# Altium schematic sheet Input.SchDoc
size A4
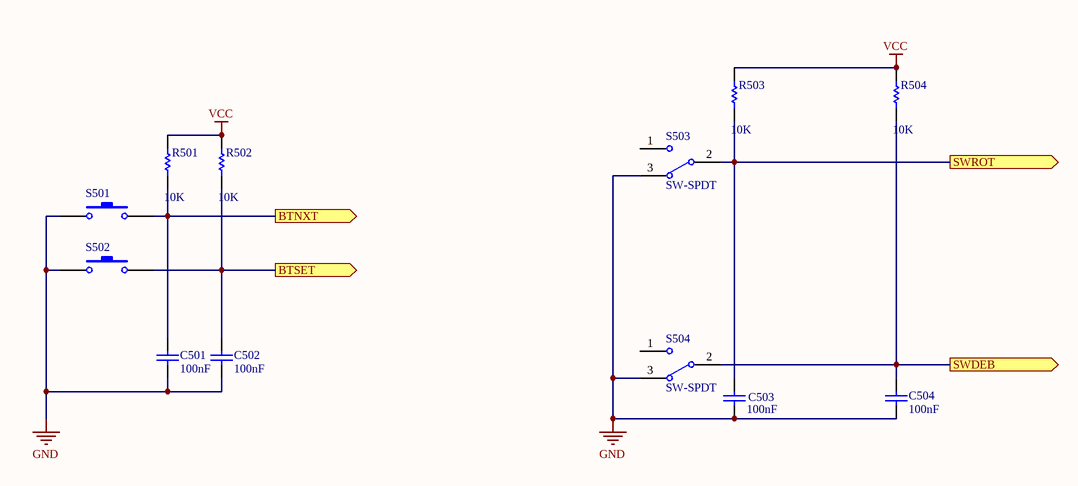
[diagram p0: Input.SchDoc]

## Parts
C501  value 100nF  [RCL 0805]  (hidden comment: Cap Semi)
C502  value 100nF  [RCL 0805]  (hidden comment: Cap Semi)
C503  value 100nF  [RCL 0805]  (hidden comment: Cap Semi)
C504  value 100nF  [RCL 0805]  (hidden comment: Cap Semi)
R501  value 10K  [RCL 0805]  (hidden comment: ERA6Y)
R502  value 10K  [RCL 0805]  (hidden comment: ERA6Y)
R503  value 10K  [RCL 0805]  (hidden comment: ERA6Y)
R504  value 10K  [RCL 0805]  (hidden comment: ERA6Y)
S501  SW-PB  [Square SMD Switch 01]  (value not drawn)
S502  SW-PB  [Square SMD Switch 01]  (value not drawn)
S503  SW-SPDT  [TL36WW15050]
S504  SW-SPDT  [TL36WW15050]

## Ports
BTNXT (out), BTSET (out), SWDEB (out), SWROT (out)

## Nets
GND: C501.1 C502.1 C503.1 C504.1 S501.1 S502.1 S503.3 S504.3
VCC: R501.2 R502.2 R503.2 R504.2
BTNXT: C501.2 R501.1 S501.2 ; port BTNXT
BTSET: C502.2 R502.1 S502.2 ; port BTSET
SWDEB: C504.2 R504.1 S504.2 ; port SWDEB
SWROT: C503.2 R503.1 S503.2 ; port SWROT

Not connected (* = marked no-connect by the designer): S503 1; S504 1

## Library data of the parts
C501-C504 = Cap Semi: Capacitor (Semiconductor SIM Model); Published: 8-Jun-2000; LatestRevisionDate: 29-May-2009; LatestRevisionNote: IPC-7351 Footprint Added.; PackageReference: C1206; Publisher: Altium Limited; PackageDescription: Chip Capacitor
R501-R504 = ERA6Y: Rectangular Thick Film Chip Resistor, 10 Ohm to 1M Ohm Range, 0.1% and 0.5% Tolerance, 0805 Size, 0.1 W; Note: If flow soldering, adjust pad width of PCB Footprint to 0.7 - 0.8 times the width of the resistor.; Published: 17-Dec-2003; LatestRevisionDate: 19-Mar-2004; LatestRevisionNote: Silkscreen size reduced.; PackageDocument: Mar-2003; PackageReference: ERA-0805; Publisher: Altium Limited; Code_IPC: 2012 [0805]; ComponentLink1Description: Manufacturer Link; ComponentLink1URL: http://www.panasonic.com/industrial/components/resistive_products.htm; ComponentLink2Description: Datasheet; ComponentLink2URL: http://www.panasonic.com/industrial/components/pdf/AOA0000CE8.pdf
S501 S502 = SW-PB: Switch; Published: 24-Mar-1999; LatestRevisionDate: 17-Jul-2002; LatestRevisionNote: Re-released for DXP Platform.; PackageReference: SPST-2; Publisher: Altium Limited
S503 S504 = SW-SPDT: SPDT Subminiature Toggle Switch, Right Angle Mounting, Vertical Actuation; Published: 24-Mar-1999; LatestRevisionDate: 17-Dec-2003; LatestRevisionNote: Schematic revised, PCB Footprint replaced.; DatasheetVersion: 05-Dec-2000; PackageReference: TL36WW15050; Publisher: Altium Limited; ComponentLink1Description: Manufacturer Link; ComponentLink1URL: http://www.apem.com